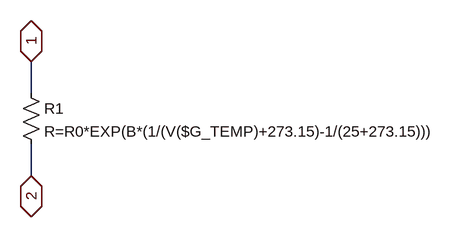
[diagram p0: schematic NTCg2.asc]
NTCg2.asc, the LTspice schematic file:
Version 4
SHEET 1 880 680
WIRE -112 192 -112 144
WIRE -112 320 -112 272
FLAG -112 144 1
IOPIN -112 144 BiDir
FLAG -112 320 2
IOPIN -112 320 BiDir
SYMBOL res -128 176 R0
SYMATTR InstName R1
SYMATTR Value R=R0*EXP(B*(1/(V($G_TEMP)+273.15)-1/(25+273.15)))

The netlist it stands for:
* NTCg2.asc
R1 1 2 R=R0*EXP(B*(1/(V($G_TEMP)+273.15)-1/(25+273.15)))
.backanno
.end